# EAGLE schematic x50_ecu (EAGLE 9.2.2)
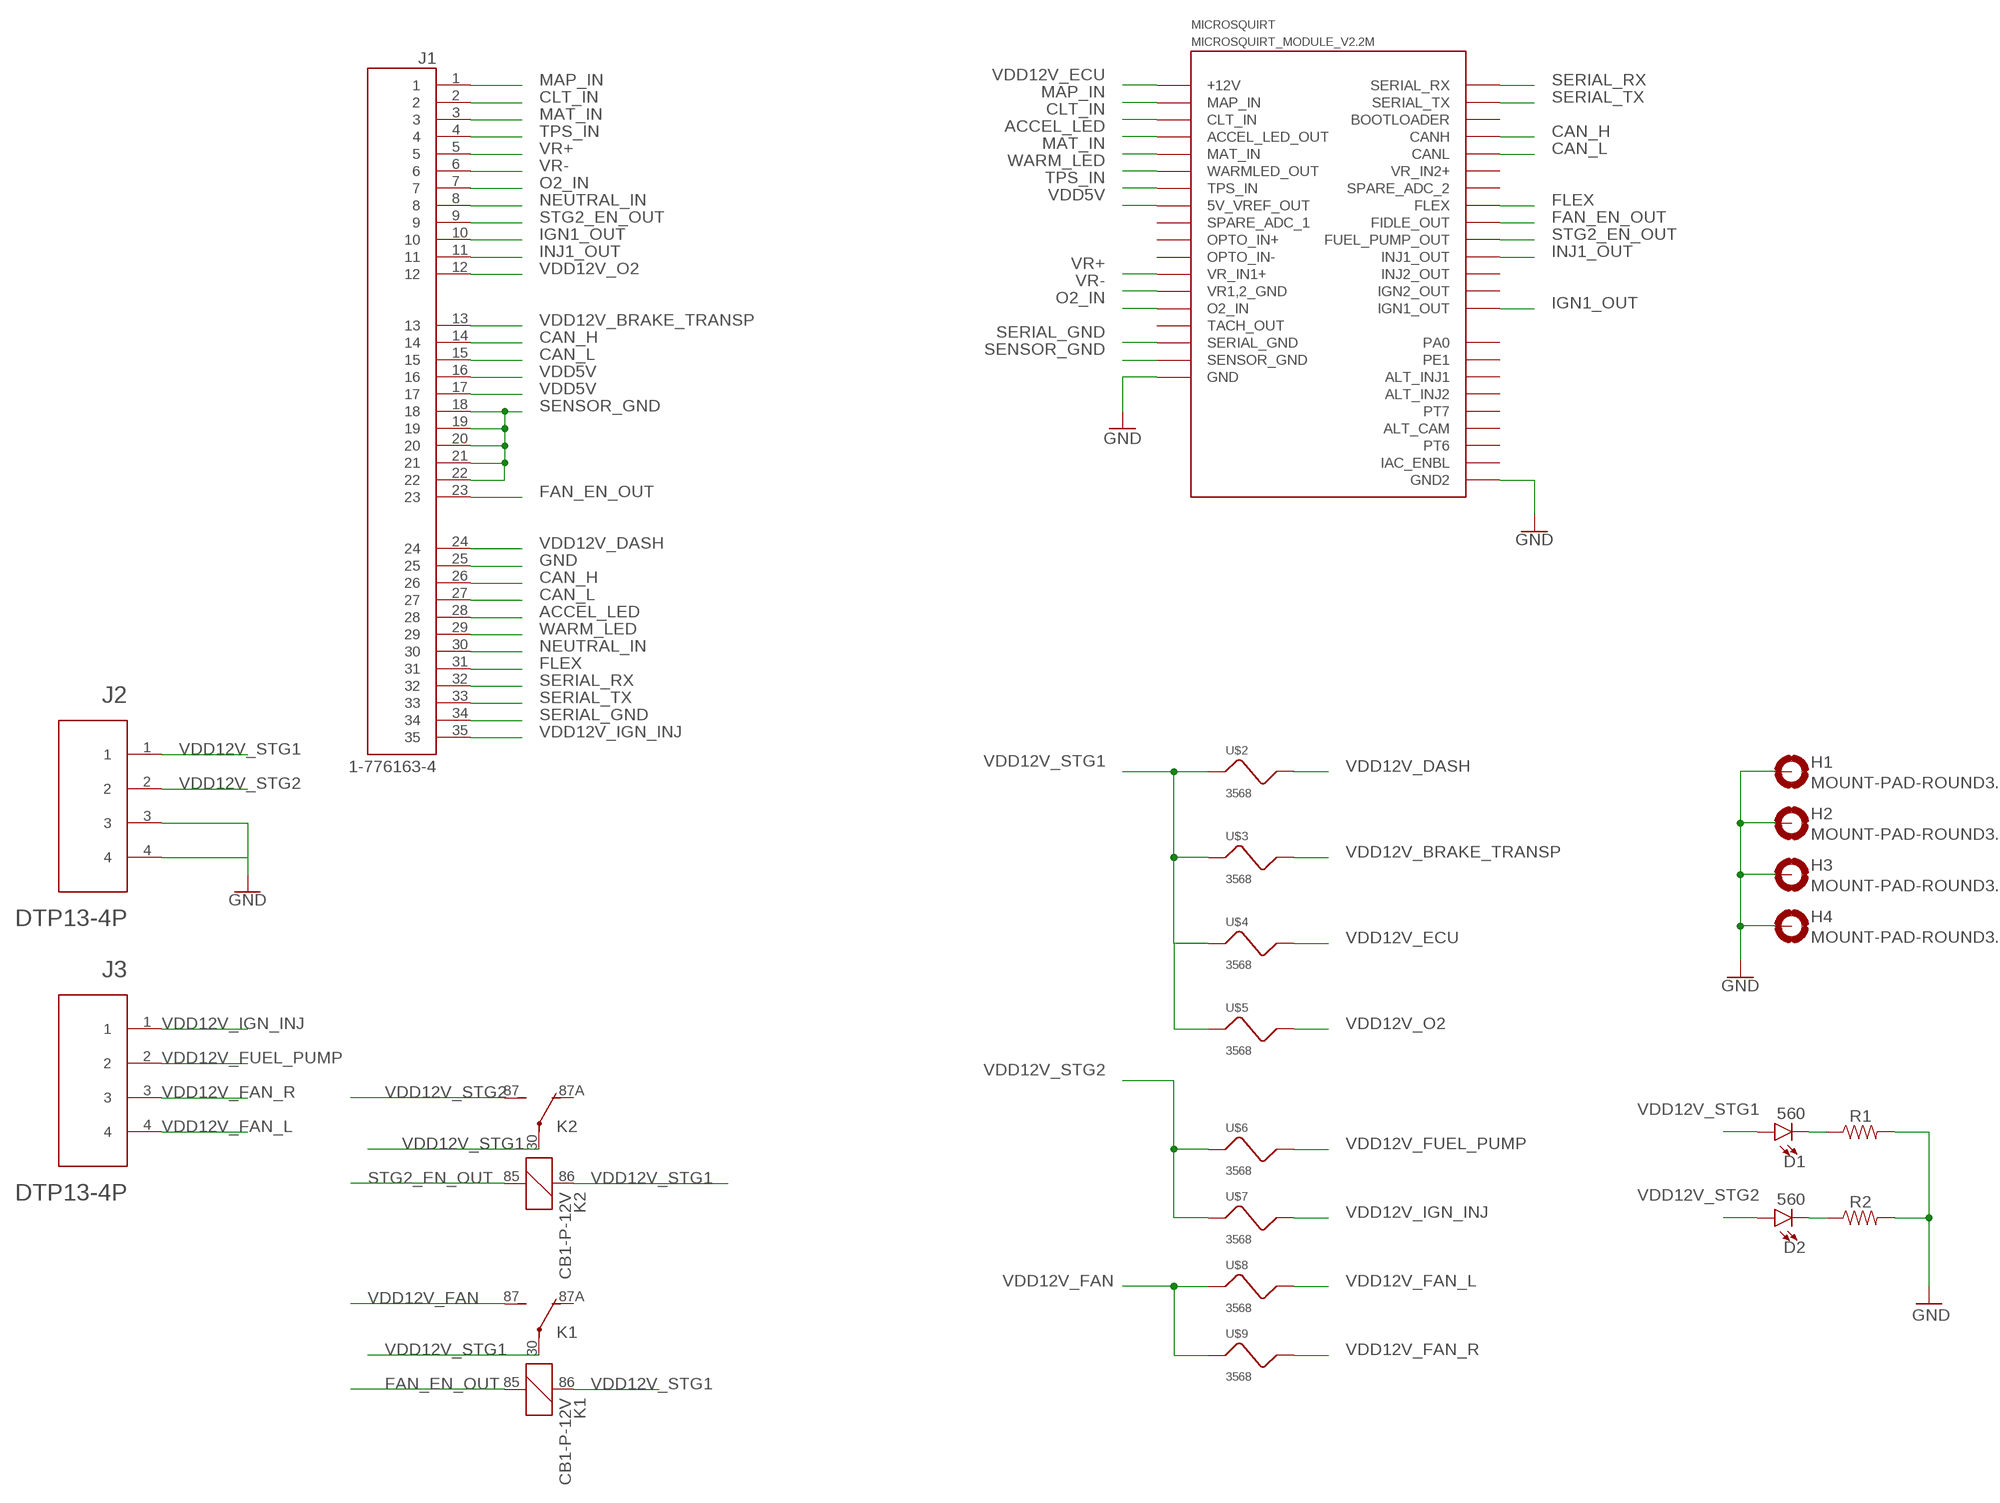
[diagram p0: schematic, sheet 1]

## Parts
D1  560  LED5MM  [LED_5MM]
D2  560  LED5MM  [LED_5MM]
H1  MOUNT-PAD-ROUND3.6  [3,6-PAD]
H2  MOUNT-PAD-ROUND3.6  [3,6-PAD]
H3  MOUNT-PAD-ROUND3.6  [3,6-PAD]
H4  MOUNT-PAD-ROUND3.6  [3,6-PAD]
J1  1-776163-4  [TE_1-776163-4]
J2  DTP13-4P  [TE_DTP13-4P]
J3  DTP13-4P  [TE_DTP13-4P]
K1  CB1-P-12V  [CB1]
K2  CB1-P-12V  [CB1]
MICROSQUIRT  MICROSQUIRT_MODULE_V2.2M  [MICROSQUIRT_MODULE_V2.2M]
R1  RESISTORAXIAL-0.3  [AXIAL-0.3]
R2  RESISTORAXIAL-0.3  [AXIAL-0.3]
U$2  3568  [3568]
U$3  3568  [3568]
U$4  3568  [3568]
U$5  3568  [3568]
U$6  3568  [3568]
U$7  3568  [3568]
U$8  3568  [3568]
U$9  3568  [3568]

## Nets
ACCEL_LED: J1.28 MICROSQUIRT.ACCEL_LED_OUT
CAN_H: J1.14 J1.26 MICROSQUIRT.CANH
CAN_L: J1.15 J1.27 MICROSQUIRT.CANL
CLT_IN: J1.2 MICROSQUIRT.CLT_IN
FAN_EN_OUT: J1.23 K1.85 MICROSQUIRT.FIDLE_OUT
FLEX: J1.31 MICROSQUIRT.FLEX
GND: H1.B3,6(MOUNT) H2.B3,6(MOUNT) H3.B3,6(MOUNT) H4.B3,6(MOUNT) J1.25 J2.3 J2.4 MICROSQUIRT.GND1_1(GND) MICROSQUIRT.GND1_2(GND) MICROSQUIRT.GND1_3(GND) MICROSQUIRT.GND1_4(GND) MICROSQUIRT.GND1_5(GND) MICROSQUIRT.GND1_6(GND) MICROSQUIRT.GND1_7(GND) MICROSQUIRT.GND1_8(GND) MICROSQUIRT.GND2_1(GND2) MICROSQUIRT.GND2_2(GND2) R1.P$2 R2.P$2
IGN1_OUT: J1.10 MICROSQUIRT.IGN1_OUT_1(IGN1_OUT) MICROSQUIRT.IGN1_OUT_2(IGN1_OUT)
INJ1_OUT: J1.11 MICROSQUIRT.INJ1_OUT_1(INJ1_OUT) MICROSQUIRT.INJ1_OUT_2(INJ1_OUT) MICROSQUIRT.INJ1_OUT_3(INJ1_OUT) MICROSQUIRT.INJ1_OUT_4(INJ1_OUT) MICROSQUIRT.INJ1_OUT_5(INJ1_OUT)
MAP_IN: J1.1 MICROSQUIRT.MAP_IN
MAT_IN: J1.3 MICROSQUIRT.MAT_IN
N$1: D1.K(C) R1.P$1
N$2: D2.K(C) R2.P$1
NEUTRAL_IN: J1.8 J1.30
O2_IN: J1.7 MICROSQUIRT.O2_IN
SENSOR_GND: J1.18 J1.19 J1.20 J1.21 J1.22 MICROSQUIRT.SENSOR_GND
SERIAL_GND: J1.34 MICROSQUIRT.SERIAL_GND
SERIAL_RX: J1.32 MICROSQUIRT.SERIAL_RX
SERIAL_TX: J1.33 MICROSQUIRT.SERIAL_TX
STG2_EN_OUT: J1.9 K2.85 MICROSQUIRT.FUEL_PUMP_OUT
TPS_IN: J1.4 MICROSQUIRT.TPS_IN
VDD5V: J1.16 J1.17 MICROSQUIRT.5V_VREF_OUT
VDD12V_BRAKE_TRANSP [PWR]: J1.13 U$3.R_1 U$3.R_2
VDD12V_DASH [PWR]: J1.24 U$2.R_1 U$2.R_2
VDD12V_ECU: MICROSQUIRT.+12V_1(+12V) MICROSQUIRT.+12V_2(+12V) U$4.R_1 U$4.R_2
VDD12V_FAN [PWR]: K1.87(2:S) U$8.L_1 U$8.L_2 U$9.L_1 U$9.L_2
VDD12V_FAN_L: J3.4 U$8.R_1 U$8.R_2
VDD12V_FAN_R: J3.3 U$9.R_1 U$9.R_2
VDD12V_FUEL_PUMP [PWR]: J3.2 U$6.R_1 U$6.R_2
VDD12V_IGN_INJ [PWR]: J1.35 J3.1 U$7.R_1 U$7.R_2
VDD12V_O2 [PWR]: J1.12 U$5.R_1 U$5.R_2
VDD12V_STG1 [PWR]: D1.A J2.1 K1.30(2:P) K1.86 K2.30(2:P) K2.86 U$2.L_1 U$2.L_2 U$3.L_1 U$3.L_2 U$4.L_1 U$4.L_2 U$5.L_1 U$5.L_2
VDD12V_STG2 [PWR]: D2.A J2.2 K2.87(2:S) U$6.L_1 U$6.L_2 U$7.L_1 U$7.L_2
VR+: J1.5 MICROSQUIRT.VR_IN1+
VR-: J1.6 MICROSQUIRT.VR1,2_GND
WARM_LED: J1.29 MICROSQUIRT.WARMLED_OUT
Unconnected: K1.87A(2:O) K2.87A(2:O) MICROSQUIRT.ALT_CAM MICROSQUIRT.ALT_INJ1 MICROSQUIRT.ALT_INJ2 MICROSQUIRT.BOOTLOADER MICROSQUIRT.IAC_ENBL MICROSQUIRT.IGN2_OUT_1(IGN2_OUT) MICROSQUIRT.IGN2_OUT_2(IGN2_OUT) MICROSQUIRT.INJ2_OUT_1(INJ2_OUT) MICROSQUIRT.INJ2_OUT_2(INJ2_OUT) MICROSQUIRT.INJ2_OUT_3(INJ2_OUT) MICROSQUIRT.INJ2_OUT_4(INJ2_OUT) MICROSQUIRT.INJ2_OUT_5(INJ2_OUT) MICROSQUIRT.OPTO_IN+ MICROSQUIRT.OPTO_IN- MICROSQUIRT.PA0 MICROSQUIRT.PE1 MICROSQUIRT.PT6 MICROSQUIRT.PT7 MICROSQUIRT.SPARE_ADC_1 MICROSQUIRT.SPARE_ADC_2 MICROSQUIRT.TACH_OUT MICROSQUIRT.VR_IN2+

## Library data of the parts
D1 D2 = SparkFun-LED:LED: LED (Generic) Standard schematic elements and footprints for 5mm, 3mm, 1206, and 0603 sized LEDs. Generic LEDs with no color specified.
H1-H4 = holes:MOUNT-PAD-ROUND: MOUNTING PAD, round
J1 = te_connectivity:1-776163-4: TE Connectivity AMPSEAL 35 POS RTANG HDR ASSY W/GASKET; COMPLIANCE: Lead free/RoHS compliant; CURRENT_RATING: Varies by Wire gauge; DATASHEET: http://www.te.com/commerce/DocumentDelivery/DDEController?Action=srchrtrv&DocNm=776163&DocType=Customer+Drawing&DocLang=English; FOOTPRINT: TE_1-776163-4; LATEST_REV_DATE: 09, March 2016; LIBRARY_REF: 1-776163-4.lbr; MANUFACTURER: TE Connectivity; PACKAGE: Panel Mount, Through Hole, Right angled; PART_DESCRIPTION: CONN HEADER 35POS R/A GOLD GRAY; PART_REV: J8; PITCH: 4mm; POS: 35; SPICEPREFIX: X; STANDARD: Manufacturer Recommendations; TE_PN: 1-776163-4; VOLTAGE_RATING: 250VAC
J2 J3 = te_connectivity:DTP13-4P: TE CONNECTIVITY Dtp Recp 4#12 Pin 90 Deg; AVAILABILITY: In stock; DESCRIPTION: Dtp Recp 4#12 Pin 90 Deg; MF: TE Connectivity; MPN: DTP13-4P; PARTREV: B1; STANDARD: Manufacturer recommendation
K1 K2 = relay:CB1*: HIGH POWER AUTOMOTIVE RELAY Form C NAiS Source: http://www.mew-europe.com/.. en_ds_61202_0000.pdf; MF: AROMAT/ MATSUSHITA; MPN: CB1-P-12V; OC_FARNELL: unknown; OC_NEWARK: 52F9201
MICROSQUIRT = microsquirt:MICROSQUIRT_MODULE_V2.2M: Microsquirt Module V2.2M. This part is a board-mounted card design.
R1 R2 = SparkFun-Resistors:RESISTOR: Generic Resistor Package
U$2-U$9 = keystone_electronics:3568: KEYSTONE ELECTRONICS 3568 ATM FUSE

## Net classes
0 default: clearance 0.205 mm
1 PWR: width 0.508 mm, drill 0.55 mm, clearance 0.205 mm to class 0, clearance 0.205 mm